# Altium schematic sheet g_l.SchDoc
size A
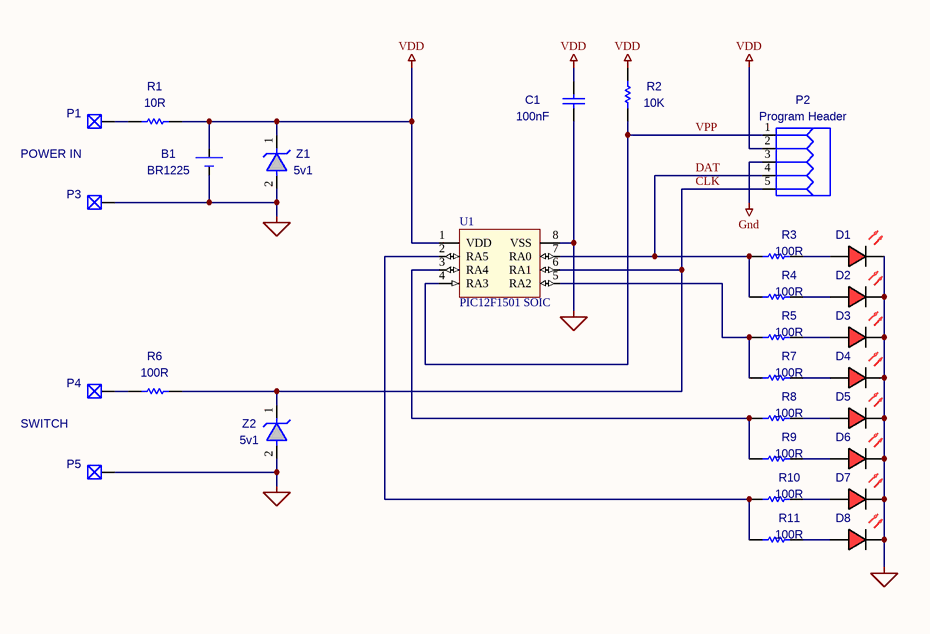
[diagram p0: g_l.SchDoc]

## Parts
B1  BR1225  [BHSD 1225 SM]
C1  100nF  [CAPC0603(1608)100_N]
D1  Side View  [LED Side Minimum]  (value not drawn)
D2  Side View  [LED Side Minimum]  (value not drawn)
D3  Side View  [LED Side Minimum]  (value not drawn)
D4  Side View  [LED Side Minimum]  (value not drawn)
D5  Side View  [LED Side Minimum]  (value not drawn)
D6  Side View  [LED Side Minimum]  (value not drawn)
D7  Side View  [LED Side Minimum]  (value not drawn)
D8  Side View  [LED Side Minimum]  (value not drawn)
P1  HOLE35-70-22GA  [HOLE35-70-22GA]  (value not drawn)
P2  Program Header  [ProgHeader]
P3  HOLE35-70-22GA  [HOLE35-70-22GA]  (value not drawn)
P4  HOLE35-70-22GA  [HOLE35-70-22GA]  (value not drawn)
P5  HOLE35-70-22GA  [HOLE35-70-22GA]  (value not drawn)
R1  10R  [RESC0603(1608)_N]
R2  10K  [RESC0603(1608)_N]
R3  100R  [RESC0603(1608)_N]
R4  100R  [RESC0603(1608)_N]
R5  100R  [RESC0603(1608)_N]
R6  100R  [RESC0603(1608)_N]
R7  100R  [RESC0603(1608)_N]
R8  100R  [RESC0603(1608)_N]
R9  100R  [RESC0603(1608)_N]
R10  100R  [RESC0603(1608)_N]
R11  100R  [RESC0603(1608)_N]
U1  PIC12F1501 SOIC  [MICROCHIP SOIC 8 Narrow]
Z1  5v1  [MM3Z]
Z2  5v1  [MM3Z]

## Nets
GND: B1.2(-) C1.1 D1.1(Cathode) D2.1(Cathode) D3.1(Cathode) D4.1(Cathode) D5.1(Cathode) D6.1(Cathode) D7.1(Cathode) D8.1(Cathode) P2.3 P3.1 P5.1 U1.8(VSS) Z1.2 Z2.2
VDD: B1.1(+) C1.2 P2.2 R1.2 R2.1 U1.1(VDD) Z1.1
CLK: P2.5 R6.2 U1.6(RA1) Z2.1
DAT: P2.4 R3.1 R4.1 U1.7(RA0)
VPP: P2.1 R2.2 U1.4(RA3)
NetD1_2: D1.2(Anode) R3.2
NetD2_2: D2.2(Anode) R4.2
NetD3_2: D3.2(Anode) R5.2
NetD4_2: D4.2(Anode) R7.2
NetD5_2: D5.2(Anode) R8.2
NetD6_2: D6.2(Anode) R9.2
NetD7_2: D7.2(Anode) R10.2
NetD8_2: D8.2(Anode) R11.2
NetP1_1: P1.1 R1.1
NetP4_1: P4.1 R6.1
NetR5_1: R5.1 R7.1 U1.5(RA2)
NetR8_1: R8.1 R9.1 U1.3(RA4)
NetR10_1: R10.1 R11.1 U1.2(RA5)

## Notes on the sheet
- POWER IN
- SWITCH

## Library data of the parts
B1 = BHSD 1225 SM: BHSD 1225 Battery Holder; AS P/N: BHSD-1225-SM
C1 = CMP-1035-02592-1: CAP 100nF 50V ±10% 0603 (1608 Metric) Thickness 1mm SMD; Case-Metric: 1608; Case-EIA: 0603; AS P/N: ASC_100N_0603; Value: 100nF; Tolerance: ±10%
D1-D8 = LED_Side View: LED Side View; ModifyDate: 11/19/2010 06:25:10; Value: *
P2 = ProgHeader: Programming header; AS P/N: GRPB051VWVN-RC; ModifyDate: 12/09/2009 15:24:36
R1 = CMP-1012-00284-1: 10R 0.1W 1% 0603 (1608 Metric)  SMD; Case-Metric: 1608; Case-EIA: 0603; Value: 10.00 Ohm; Tolerance: 1 %; Power: 0.1 W; Technology: SMT
R2 = CMP-1012-00623-1: 10K 0.1W 1% 0603 (1608 Metric)  SMD; Value: 10000.00 Ohm; Case-EIA: 0603; Case-Metric: 1608; AS P/N: ASR_10K0_0603; Tolerance: 1 %
R3-R11 = CMP-1012-00397-1: 100R 0.1W 1% 0603 (1608 Metric)  SMD; Value: 100.00 Ohm; Case-EIA: 0603; Case-Metric: 1608; AS P/N: ASR_100R_0603; Technology: SMT; Tolerance: 1 %; Power: 0.1 W
U1 = PIC12F1501 SOIC: AS P/N: PIC12F1501_SOIC
Z1 Z2 = MM3Z5V1: Zener Diode, SOD323, 5.1v, 200 mW; AS P/N: MM3Z5V1
P1 P3-P5 = HOLE35-70-22GA: ModifyDate: 11/19/2010 06:25:10; Value: *